# EAGLE board AQ_Baloo_t (EAGLE 5.11)
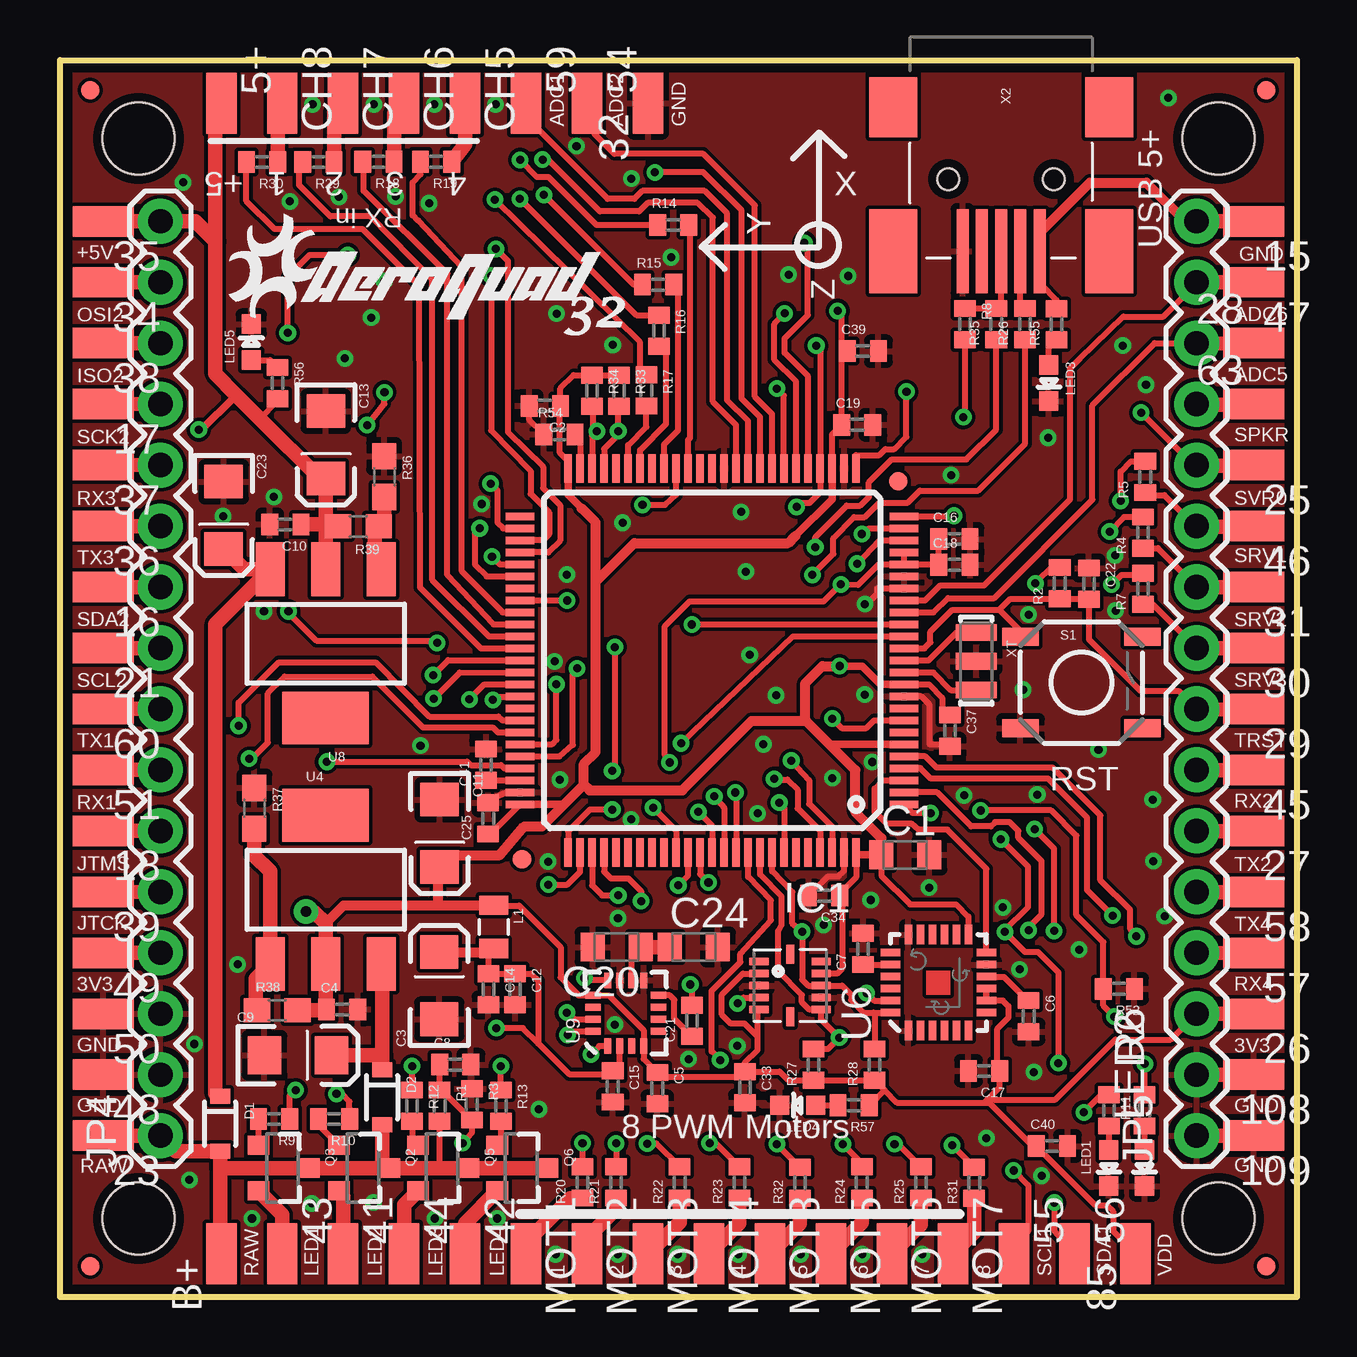
[diagram p1: board, top side]
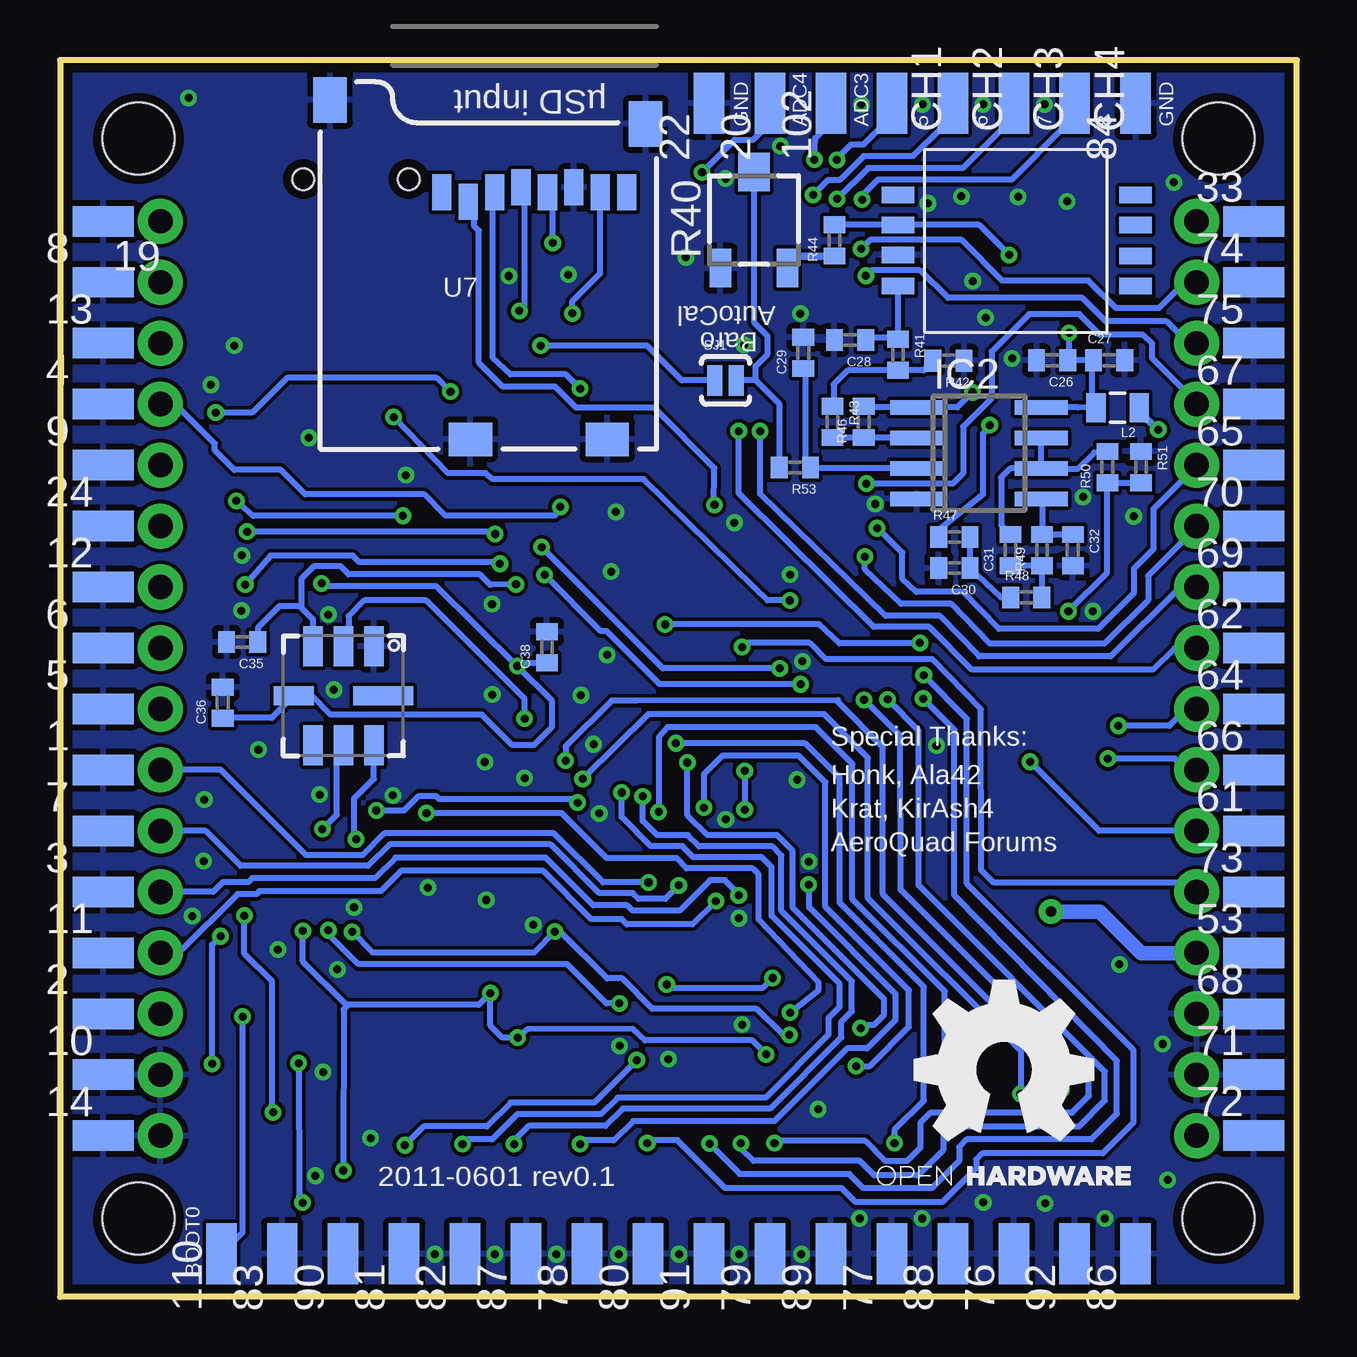
[diagram p2: board, bottom side, seen from below]

Size 51.54 x 51.54 mm. Coordinates in mm from the lower left corner, seen from the top.
Outline: 0,0 0,51.54 51.54,51.54 51.54,0 0,0
Copper layers (1*16): Top 0.0356mm / dielectric 1.5011mm / Bottom 0.0356mm
Design rules "LaenPCBOrder *": minimum track width 6mil, minimum drill 13mil, track to track 6mil, track to pad 6mil, pad to pad 6mil, via to via 6mil, smd to smd 6mil, copper to edge 15mil, drill to drill 6mil, minimum pad ring 7mil, minimum via ring 7mil, stop-mask expansion 4mil, vias tented up to drill 0mil, thermal gap 10mil
Net classes: 0 default: width 0.203 mm; 1 vcc: width 0.254 mm
Holes 3 mm at 3.27,48.27 48.27,48.27 48.27,3.27 3.27,3.27

## Footprints (pad centres in the part's own frame; a part is rotated, then mirrored left to right if it is on the bottom)
SMD1,27-2,54 = smd 1.27 x 2.54: 1 0,0
SMC_Z = smd 1 x 1.2: + -1,0; - 1,0
C0402 = smd 0.7 x 0.9: 1 -0.65,0; 2 0.65,0
EIA3216 = smd 1.4 x 1.6: A 1.4,0; C -1.4,0
SOD-323 = smd 0.63 x 0.83: 1 -1.15,0; 2 1.15,0
TQFP100 = smd 1.2 x 0.3: 1 -8,6; 2 -8,5.5; 3 -8,5; 4 -8,4.5; 5 -8,4; 6 -8,3.5; 7 -8,3; 8 -8,2.5; 9 -8,2; 10 -8,1.5; 11 -8,1; 12 -8,0.5; 13 -8,0; 14 -8,-0.5; 15 -8,-1; 16 -8,-1.5; 17 -8,-2; 18 -8,-2.5; 19 -8,-3; 20 -8,-3.5; 21 -8,-4; 22 -8,-4.5; 23 -8,-5; 24 -8,-5.5; 25 -8,-6; 51 8,-6; 52 8,-5.5; 53 8,-5; 54 8,-4.5; 55 8,-4; 56 8,-3.5; 57 8,-3; 58 8,-2.5; 59 8,-2; 60 8,-1.5; 61 8,-1; 62 8,-0.5; 63 8,0; 64 8,0.5; 65 8,1; 66 8,1.5; 67 8,2; 68 8,2.5; 69 8,3; 70 8,3.5; 71 8,4; 72 8,4.5; 73 8,5; 74 8,5.5; 75 8,6 | smd 0.3 x 1.2: 26 -6,-8; 27 -5.5,-8; 28 -5,-8; 29 -4.5,-8; 30 -4,-8; 31 -3.5,-8; 32 -3,-8; 33 -2.5,-8; 34 -2,-8; 35 -1.5,-8; 36 -1,-8; 37 -0.5,-8; 38 0,-8; 39 0.5,-8; 40 1,-8; 41 1.5,-8; 42 2,-8; 43 2.5,-8; 44 3,-8; 45 3.5,-8; 46 4,-8; 47 4.5,-8; 48 5,-8; 49 5.5,-8; 50 6,-8; 76 6,8; 77 5.5,8; 78 5,8; 79 4.5,8; 80 4,8; 81 3.5,8; 82 3,8; 83 2.5,8; 84 2,8; 85 1.5,8; 86 1,8; 87 0.5,8; 88 0,8; 89 -0.5,8; 90 -1,8; 91 -1.5,8; 92 -2,8; 93 -2.5,8; 94 -3,8; 95 -3.5,8; 96 -4,8; 97 -4.5,8; 98 -5,8; 99 -5.5,8; 100 -6,8
SO08 = smd 0.6 x 2.2: 1 -1.905,-2.6; 2 -0.635,-2.6; 3 0.635,-2.6; 4 1.905,-2.6; 5 1.905,2.6; 6 0.635,2.6; 7 -0.635,2.6; 8 -1.905,2.6
1X16 = drill 1.016 pad 1.88 round: 1 0,0; 2 2.54,0; 3 5.08,0; 4 7.62,0; 5 10.16,0; 6 12.7,0; 7 15.24,0; 8 17.78,0; 9 20.32,0; 10 22.86,0; 11 25.4,0; 12 27.94,0; 13 30.48,0; 14 33.02,0; 15 35.56,0; 16 38.1,0
0805 = smd 0.8 x 1.2: 1 -0.9,0; 2 0.9,0
LED-0603 = smd 0.8 x 0.8: A 0,-0.75; C 0,0.75
SOT23-3 = smd 0.8 x 0.9: 1 -0.95,-1; 2 0.95,-1; 3 0,1.1
0603 = smd 1.1 x 1: 1 -0.85,0; 2 0.85,0
3223J = smd 1.6 x 0.9: 1 -2,1.4; 3 -2,-1.4 | smd 1.6 x 1.3: 2 2,0
TACTILE_SWITCH_SMD = smd 1.524 x 0.762: 1 -2.54,1.905; 2 2.54,1.905; 3 -2.54,-1.905; 4 2.54,-1.905
SJ_2S-NO = smd 0.635 x 1.27: 1 -0.45,0; 2 0.45,0
LGA12 = smd 0.8 x 0.32: P$1 -1.3,1; P$2 -1.3,0.5; P$3 -1.3,0; P$4 -1.3,-0.5; P$5 -1.3,-1; P$7 1.3,-1; P$8 1.3,-0.5; P$9 1.3,0; P$10 1.3,0.5; P$11 1.3,1 | smd 0.32 x 0.8: P$6 0,-1.3; P$12 0,1.3
SOT223 = smd 1.219 x 2.235: 1 -2.311,-3.099; 2 0,-3.099; 3 2.311,-3.099 | smd 3.6 x 2.2: 4 0,3.099
QFN-24 = smd 0.8 x 0.3: 1 -2,1.25; 2 -2,0.75; 3 -2,0.25; 4 -2,-0.25; 5 -2,-0.75; 6 -2,-1.25; 13 2,-1.25; 14 2,-0.75; 15 2,-0.25; 16 2,0.25; 17 2,0.75; 18 2,1.25 | smd 0.3 x 0.8: 7 -1.25,-2; 8 -0.75,-2; 9 -0.25,-2; 10 0.25,-2; 11 0.75,-2; 12 1.25,-2; 19 1.25,2; 20 0.75,2; 21 0.25,2; 22 -0.25,2; 23 -0.75,2; 24 -1.25,2
MICRO-SD-SOCKET-PP = smd 0.8 x 1.5: 1 -8.94,10.7; 2 -7.84,10.3; 3 -6.74,10.7; 4 -5.64,10.9; 5 -4.54,10.7; 6 -3.44,10.9; 7 -2.34,10.7; 8 -1.24,10.7 | smd 1.8 x 1.4: CD1 -2.05,0.4; CD2 -7.75,0.4 | smd 1.4 x 1.9: GND1 -13.6,14.55; GND3 -0.45,13.55
16LPCC = smd 0.65 x 0.28: 1 -1.37,0.75; 2 -1.37,0.25; 3 -1.37,-0.25; 4 -1.37,-0.75; 9 1.37,-0.75; 10 1.37,-0.25; 11 1.37,0.25; 12 1.37,0.75 | smd 0.28 x 0.65: 5 -0.75,-1.37; 6 -0.25,-1.37; 7 0.25,-1.37; 8 0.75,-1.37; 13 0.75,1.37; 14 0.25,1.37; 15 -0.25,1.37; 16 -0.75,1.37
MPX_SMD = smd 1.35 x 0.69 bottom: GND -1.1,4.4; P$1 8.8,5.7; P$2 -1.1,1.9; P$3 8.8,4.45; P$4 8.8,3.15; P$5 8.8,1.9; VCC -1.1,3.15; VOUT -1.1,5.7
BMP085 = smd 1.67 x 0.8: 1 -2.065,1.27; 2 -2.065,0; 3 -2.065,-1.27; 5 2.065,-1.27; 6 2.065,0; 7 2.065,1.27 | smd 0.8 x 1.67: 4 0,-2.065 | smd 0.8 x 2.5: 8 0,1.65
PAD.03X.03 = smd 0.762 x 0.762: P$1 0,0
USB-MINIB-OLD = smd 2.5 x 2: 1 -3,-4.5; 2 -3,4.5 | smd 3.5 x 2: 3 3,-4.5; 4 3,4.5 | smd 3.5 x 0.5: D+ 3,0; D- 3,0.8; GND 3,-1.6; ID 3,-0.8; VBUS 3.01,1.61 | hole 0.9: 0,2.2; 0,-2.2
RESONATOR-SMD = smd 0.7 x 1.7: 1 -1.2,0; 2 0,0; 3 1.2,0

## Placement (x,y rotation side)
1  Ser1  [SMD1,27-2,54]  49.74,21.96 270 bottom
2  Ser1  [SMD1,27-2,54]  49.74,11.8 270 bottom
3  Ser1  [SMD1,27-2,54]  49.74,16.88 270 bottom
4  Ser1  [SMD1,27-2,54]  49.74,37.2 270 bottom
5  Ser1  [SMD1,27-2,54]  49.74,24.5 270 bottom
5+  [SMD1,27-2,54]  6.72,49.74 180 top
6  Ser1  [SMD1,27-2,54]  49.74,27.04 270 bottom
7  Ser1  [SMD1,27-2,54]  49.74,19.42 270 bottom
8  Ser1  [SMD1,27-2,54]  49.74,42.28 270 bottom
9  Ser1  [SMD1,27-2,54]  49.74,34.66 270 bottom
10  Ser1  [SMD1,27-2,54]  49.74,9.26 270 bottom
11  Ser1  [SMD1,27-2,54]  49.74,14.34 270 bottom
12  Ser1  [SMD1,27-2,54]  49.74,29.58 270 bottom
13  Ser1  [SMD1,27-2,54]  49.74,39.74 270 bottom
14  Ser1  [SMD1,27-2,54]  49.74,6.72 270 bottom
15  [SMD1,27-2,54]  49.74,44.82 90 top
16  [SMD1,27-2,54]  1.8,29.58 90 top
17  [SMD1,27-2,54]  1.8,37.2 90 top
18  [SMD1,27-2,54]  1.8,19.42 90 top
19  Ser1  [SMD1,27-2,54]  49.74,44.82 90 bottom
20  Ser1  [SMD1,27-2,54]  21.96,49.74 0 bottom
21  [SMD1,27-2,54]  1.8,27.04 90 top
22  Ser1  [SMD1,27-2,54]  24.5,49.74 0 bottom
23  [SMD1,27-2,54]  1.8,6.72 90 top
24  Ser1  [SMD1,27-2,54]  49.74,32.12 270 bottom
25  [SMD1,27-2,54]  49.74,34.66 90 top
26  [SMD1,27-2,54]  49.74,11.8 90 top
27  [SMD1,27-2,54]  49.74,19.42 90 top
28  Ser1  [SMD1,27-2,54]  49.74,39.74 270 top
29  [SMD1,27-2,54]  49.74,24.5 90 top
30  [SMD1,27-2,54]  49.74,27.04 90 top
31  [SMD1,27-2,54]  49.74,29.58 90 top
32  Ser1  [SMD1,27-2,54]  24.5,49.74 0 top
33  Ser1  [SMD1,27-2,54]  1.8,44.82 270 bottom
34  [SMD1,27-2,54]  1.8,42.28 90 top
35  [SMD1,27-2,54]  1.8,44.82 90 top
36  [SMD1,27-2,54]  1.8,32.12 90 top
37  [SMD1,27-2,54]  1.8,34.66 90 top
38  [SMD1,27-2,54]  1.8,39.74 90 top
39  [SMD1,27-2,54]  1.8,16.88 90 top
41  [SMD1,27-2,54]  11.8,1.8 180 top
42  [SMD1,27-2,54]  16.88,1.8 180 top
43  [SMD1,27-2,54]  9.26,1.8 180 top
44  [SMD1,27-2,54]  14.34,1.8 180 top
45  [SMD1,27-2,54]  49.74,21.96 90 top
46  [SMD1,27-2,54]  49.74,32.12 90 top
47  [SMD1,27-2,54]  49.74,42.28 90 top
48  [SMD1,27-2,54]  1.8,9.26 90 top
49  [SMD1,27-2,54]  1.8,14.34 90 top
50  [SMD1,27-2,54]  1.8,11.8 90 top
51  [SMD1,27-2,54]  1.8,21.96 90 top
53  Ser1  [SMD1,27-2,54]  1.8,14.34 270 bottom
54  Ser1  [SMD1,27-2,54]  21.96,49.74 180 top
55  [SMD1,27-2,54]  39.74,1.8 180 top
56  [SMD1,27-2,54]  42.28,1.8 180 top
57  [SMD1,27-2,54]  49.74,14.34 90 top
58  [SMD1,27-2,54]  49.74,16.88 90 top
59  Ser1  [SMD1,27-2,54]  19.42,49.74 180 top
60  [SMD1,27-2,54]  1.8,24.5 90 top
61  Ser1  [SMD1,27-2,54]  1.8,19.42 270 bottom
62  Ser1  [SMD1,27-2,54]  1.8,27.04 270 bottom
63  Ser1  [SMD1,27-2,54]  49.74,37.2 270 top
64  Ser1  [SMD1,27-2,54]  1.8,24.5 270 bottom
65  Ser1  [SMD1,27-2,54]  1.8,34.66 270 bottom
66  Ser1  [SMD1,27-2,54]  1.8,21.96 270 bottom
67  Ser1  [SMD1,27-2,54]  1.8,37.2 270 bottom
68  Ser1  [SMD1,27-2,54]  1.8,11.8 270 bottom
69  Ser1  [SMD1,27-2,54]  1.8,29.58 270 bottom
70  Ser1  [SMD1,27-2,54]  1.8,32.12 270 bottom
71  Ser1  [SMD1,27-2,54]  1.8,9.26 270 bottom
72  Ser1  [SMD1,27-2,54]  1.8,6.72 270 bottom
73  Ser1  [SMD1,27-2,54]  1.8,16.88 270 bottom
74  Ser1  [SMD1,27-2,54]  1.8,42.28 270 bottom
75  Ser1  [SMD1,27-2,54]  1.8,39.74 270 bottom
76  Ser1  [SMD1,27-2,54]  11.8,1.8 0 bottom
77  Ser1  [SMD1,27-2,54]  16.88,1.8 0 bottom
78  Ser1  [SMD1,27-2,54]  29.58,1.8 0 bottom
79  Ser1  [SMD1,27-2,54]  21.96,1.8 0 bottom
80  Ser1  [SMD1,27-2,54]  27.04,1.8 0 bottom
81  Ser1  [SMD1,27-2,54]  37.2,1.8 0 bottom
82  Ser1  [SMD1,27-2,54]  34.66,1.8 0 bottom
83  Ser1  [SMD1,27-2,54]  42.28,1.8 0 bottom
84  Ser1  [SMD1,27-2,54]  6.72,49.74 0 bottom
85  Ser1  [SMD1,27-2,54]  44.82,1.8 0 top
86  Ser1  [SMD1,27-2,54]  6.72,1.8 0 bottom
87  Ser1  [SMD1,27-2,54]  32.12,1.8 0 bottom
88  Ser1  [SMD1,27-2,54]  14.34,1.8 0 bottom
89  Ser1  [SMD1,27-2,54]  19.42,1.8 0 bottom
90  Ser1  [SMD1,27-2,54]  39.74,1.8 0 bottom
91  Ser1  [SMD1,27-2,54]  24.5,1.8 0 bottom
92  Ser1  [SMD1,27-2,54]  9.26,1.8 0 bottom
102  Ser1  [SMD1,27-2,54]  19.42,49.74 0 bottom
108  [SMD1,27-2,54]  49.74,9.26 90 top
109  [SMD1,27-2,54]  49.74,6.72 90 top
110  [SMD1,27-2,54]  44.82,1.8 0 bottom
B+  [SMD1,27-2,54]  6.72,1.8 0 top
C1  10uF  [SMC_Z]  35.22,18.42 0 top
C2  0.1uF  [C0402]  20.2,37.13 180 top
C3  10uF  [EIA3216]  15.8,12.97 90 top
C4  0.1uF  [C0402]  11.76,11.98 0 top
C5  10nF  [C0402]  24.89,8.7 270 top
C6  0.1uF  [C0402]  40.36,11.7 270 top
C7  2.2nF  [C0402]  33.46,14.5 90 top
C8  0.1µF  [C0402]  16.47,9.68 0 top
C9  10uF (25V)  [EIA3216]  9.92,10.07 0 top
C10  0.1uF  [C0402]  9.39,32.19 180 top
C11  10uF  [EIA3216]  15.82,19.32 270 top
C12  0.1uF  [C0402]  18.96,12.82 270 top
C13  10uF  [EIA3216]  11.08,35.51 270 top
C14  1uF  [C0402]  17.85,12.82 270 top
C15  0.1uF  [C0402]  23.03,8.77 270 top
C16  1uF  [C0402]  37.27,31.58 0 top
C17  0.1uF  [C0402]  38.5,9.42 180 top
C18  10nF  [C0402]  37.27,30.51 0 top
C19  0.1uF  [C0402]  33.22,36.34 0 top
C20  1uF (ESR)  [SMC_Z]  23.19,14.58 180 top
C21  0.22uF  [C0402]  26.33,11.51 90 top
C22  0.1uF  [C0402]  42.87,29.72 270 top
C23  10uF (25V)  [EIA3216]  6.82,32.57 270 top
C24  1uF (ESR)  [SMC_Z]  26.41,14.58 0 top
C25  0.1uF  [C0402]  17.84,19.94 90 top
C26  0.1uF  [C0402]  10.2,39.03 180 bottom
C27  1uF  [C0402]  7.83,39.03 0 bottom
C28  470pF  [C0402]  18.62,39.87 180 bottom
C29  1µF  [C0402]  20.57,39.34 90 bottom
C30  1uF  [C0402]  14.27,30.37 180 bottom
C31  1uF  [C0402]  11.94,31.12 90 bottom
C32  1uF  [C0402]  9.34,31.12 270 bottom
C33  0.1uF  [C0402]  28.54,8.74 270 top
C34  0.1uF  [C0402]  31.84,16.72 180 top
C35  0.1uF  [C0402]  43.95,27.29 180 bottom
C36  0.1uF  [C0402]  44.76,24.76 90 bottom
C37  0.1uF  [C0402]  37.08,23.6 270 top
C38  0.1uF  [C0402]  31.25,27.07 90 bottom
C39  0.1uF  [C0402]  33.45,39.41 0 top
C40  0.1uF  [C0402]  41.33,6.29 0 top
C41  2.2uF  [C0402]  17.75,22.18 90 top
CH1  [SMD1,27-2,54]  16.88,49.74 180 bottom
CH2  [SMD1,27-2,54]  14.34,49.74 180 bottom
CH3  [SMD1,27-2,54]  11.8,49.74 180 bottom
CH4  [SMD1,27-2,54]  9.26,49.74 180 bottom
CH5  [SMD1,27-2,54]  16.88,49.74 180 top
CH6  [SMD1,27-2,54]  14.34,49.74 180 top
CH7  [SMD1,27-2,54]  11.8,49.74 180 top
CH8  [SMD1,27-2,54]  9.26,49.74 180 top
D1  [SOD-323]  6.67,7.22 270 top
D2  [SOD-323]  13.42,8.32 270 top
IC1  STM32F10XVXT6  [TQFP100]  27.17,26.52 180 top
IC2  TS922IN  [SO08]  13.25,35.16 270 bottom
JP4  M16PTH  [1X16]  4.18,6.72 90 top
JP5  M16PTH  [1X16]  47.36,6.72 90 top
L1  100uH  [0805]  18.07,15.42 270 top
L2  100uH  [0805]  7.47,37.05 180 bottom
LED1  Blue  [LED-0603]  43.7,5.37 180 top
LED2  Green  [LED-0603]  45.19,5.37 180 top
LED3  Blue  [LED-0603]  41.2,38.08 180 top
LED4  Blue  [LED-0603]  30.74,7.99 90 top
LED5  Blue  [LED-0603]  7.97,39.79 0 top
MOT1  [SMD1,27-2,54]  19.42,1.8 180 top
MOT2  [SMD1,27-2,54]  21.96,1.8 180 top
MOT3  [SMD1,27-2,54]  24.5,1.8 180 top
MOT4  [SMD1,27-2,54]  27.04,1.8 180 top
MOT5  [SMD1,27-2,54]  32.12,1.8 180 top
MOT6  [SMD1,27-2,54]  34.66,1.8 180 top
MOT7  [SMD1,27-2,54]  37.2,1.8 180 top
MOT8  [SMD1,27-2,54]  29.58,1.8 180 top
Q2  BCV27  [SOT23-3]  12.62,5.37 270 top
Q3  BCV27  [SOT23-3]  9.27,5.37 270 top
Q5  BCV27  [SOT23-3]  15.92,5.37 270 top
Q6  BCV27  [SOT23-3]  19.22,5.37 270 top
R1  10K  [C0402]  15.82,7.97 270 top
R2  10K  [C0402]  41.66,29.74 90 top
R3  1k5  [C0402]  17.16,8.02 270 top
R4  1K  [C0402]  45.13,31.85 90 top
R5  1K  [C0402]  45.22,34.17 90 top
R6  294R  [C0402]  45.19,7.77 270 top
R7  1K  [C0402]  45.12,29.51 90 top
R8  1k5  [C0402]  37.71,40.54 270 top
R9  1k69  [C0402]  8.92,7.42 180 top
R10  1k69  [C0402]  11.42,7.42 180 top
R11  294R  [C0402]  43.7,7.77 90 top
R12  1k69  [C0402]  14.67,7.97 270 top
R13  1k69  [C0402]  18.37,7.97 270 top
R14  1K  [C0402]  25.55,44.67 0 top
R15  1K  [C0402]  24.92,42.18 0 top
R16  1K  [C0402]  24.96,40.26 270 top
R17  1K  [C0402]  24.43,37.77 270 top
R18  1K  [C0402]  13.27,47.3 180 top
R19  1K  [C0402]  15.67,47.3 180 top
R20  1K  [C0402]  21.77,4.77 90 top
R21  1K  [C0402]  23.17,4.77 90 top
R22  1K  [C0402]  25.82,4.77 90 top
R23  1K  [C0402]  28.31,4.77 90 top
R24  1K  [C0402]  33.41,4.77 90 top
R25  1K  [C0402]  35.87,4.77 90 top
R26  22R  [C0402]  40.21,40.54 90 top
R27  4k7  [C0402]  31.4,9.68 90 top
R28  4k7  [C0402]  33.94,9.68 90 top
R29  1K  [C0402]  10.77,47.29 180 top
R30  1K  [C0402]  8.42,47.29 180 top
R31  1K  [C0402]  38.09,4.76 90 top
R32  1K  [C0402]  30.83,4.76 90 top
R33  4k7  [C0402]  23.29,37.76 270 top
R34  4k7  [C0402]  22.17,37.76 270 top
R35  22R  [C0402]  39.01,40.54 90 top
R36  732 (eff.)  [0603]  13.51,34.18 270 top
R37  402R (eff.)  [0603]  8.1,20.36 270 top
R38  243 (eff.)  [0603]  9.05,11.94 0 top
R39  243 (eff.)  [0603]  12.43,32.11 180 top
R40  10k  [3223J]  22.62,44.87 90 bottom
R41  10k  [C0402]  16.62,39.26 270 bottom
R42  10k  [C0402]  14.52,39.01 180 bottom
R43  10k  [C0402]  19.35,36.46 270 bottom
R44  10k  [C0402]  19.27,44.02 90 bottom
R46  220k  [C0402]  18.05,36.46 90 bottom
R47  47k  [C0402]  14.27,31.67 0 bottom
R48  120k  [C0402]  11.28,29.15 0 bottom
R49  6k8  [C0402]  10.62,31.12 90 bottom
R50  5k6  [C0402]  7.9,34.58 90 bottom
R51  10k  [C0402]  6.5,34.58 270 bottom
R52  10K  [C0402]  44.12,12.84 180 top
R53  1M5  [C0402]  20.92,34.56 180 bottom
R54  0k  [C0402]  20.81,35.94 0 top
R55  377R  [C0402]  41.52,40.53 90 top
R56  377R  [C0402]  9.06,38.08 270 top
R57  294R  [C0402]  33.07,7.99 180 top
S1  SW-MOM  [TACTILE_SWITCH_SMD]  42.56,25.6 0 top
SJ1  SOLDERJUMPERNO  [SJ_2S-NO]  23.81,38.19 0 bottom
U3  BMA180  [LGA12]  30.42,12.97 0 top
U4  317  [SOT223]  11.07,16.97 0 top
U6  ITG-3200  [QFN-24]  36.6,13.1 90 top
U7  USD-SOCKETNEW  [MICRO-SD-SOCKET-PP]  26.69,35.33 0 bottom
U8  317  [SOT223]  11.07,27.22 180 top
U9  HMC5883LSMD  [16LPCC]  23.57,11.82 90 top
U$2  MPX_SMD  [MPX_SMD]  15.52,47.82 180 top
U$3  BMP085  [BMP085]  39.73,25.05 270 bottom
U$4  [AQ-WORDS-PT07]  7.03,39.72 0 top
U$5  [OSHW_TEXT]  17.5,4.65 0 bottom
U$7  PAD.03  [PAD.03X.03]  1.27,1.27 0 top
U$9  PAD.03  [PAD.03X.03]  50.27,1.27 0 top
U$10  PAD.03  [PAD.03X.03]  1.27,50.27 0 top
U$11  PAD.03  [PAD.03X.03]  50.27,50.27 0 top
U$12  PAD.03  [PAD.03X.03]  19.25,18.24 0 top
U$13  PAD.03  [PAD.03X.03]  34.93,33.99 0 top
X2  USBOLD  [USB-MINIB-OLD]  39.21,46.58 270 top
XT  8MHz  [RESONATOR-SMD]  38.18,26.49 270 top

## Tracks (layer width: path | path; a pad name or v marks a point on that pad's centre or on a via)
3IN
  Top 0.406: 13.42,13.83 U4.3
  Top 0.61: 13.42,10.16 D2.1 | 13.42,10.16 13.42,13.83 | C9.A 13.33,10.07 13.42,10.16
3V3AN  (via drill 0.34 pad 0.25)
  Top 0.254: 17.92,14.37 L1.2 | C14.1 C12.1 19.62,13.47 19.92,13.17 19.92,10.57 | C14.1 17.77,13.47 17.77,13.62 | L1.2 17.67,14.52 | IC1.21 IC1.22 | C14.1 17.85,14.3 L1.2 | v18.18,11.2 19.29,11.2 19.92,10.57 | IC1.21 36.27,30.52 36.28,30.51 C18.1 C16.1 | IC1.21 34.11,30.52 33.26,29.67 v32.54,29.69 31.82,28.98 26.23,28.98 25.2,27.95 25.2,22.58 v25.4,22.27 | U9.2 23.32,9.71 C15.1 22.89,9.28 21.21,9.28 19.92,10.57
  Top 0.406: C3.A 17.92,14.37
  Bottom 0.254: v18.18,11.2 18.03,11.35 17.61,11.35 17.2,11.76 17.2,12.41 21.01,16.22 21.01,18.59 21.66,19.24 24.56,19.24 25.4,20.08 v25.4,22.27 | v32.54,29.69 33.61,29.67 34.05,30.11 39.51,30.11 39.84,30.44 40.96,30.44 41.48,29.92 41.48,28.72 | 41.48,28.72 41,28.24 U$3.3 | C35.1 43.3,27.88 42.4,28.78 41.54,28.78 41.48,28.72
3V3DIG  (via drill 0.34 pad 0.25, 0.34 pad 0.41, 0.45 pad 1.02)
  Top 0.254: 15.82,16.32 L1.1 19.13,16.31 20.86,14.58 20.86,13.32 21.61,12.57 U9.13 22.87,12.57 24.32,11.12 U9.4 24.32,9.92 C5.1 25,9.18 28.39,9.18 C33.1 | 29.32,11.97 U3.P$5 29.07,11.92 29.07,10.85 | C33.1 28.43,9.5 | 29.07,10.85 29.07,10.29 28.54,9.76 28.54,9.51 28.86,9.19 28.77,9.19 28.58,9.38 C33.1 | 29.07,10.85 28.53,11.39 27.95,11.39 27.58,11.76 27.58,12.6 28.45,13.47 U3.P$2 | IC1.11 36.21,25.52 36.76,24.97 36.76,24.4 C37.1 | C33.1 29.98,9.39 30.34,9.03 R27.1 R28.1 34.37,8.61 | U3.P$10 32.38,13.47 32.59,13.68 32.59,16.62 C34.1 32.49,16.8 33.17,17.48 IC1.100 | 11.07,12.02 C4.1 | v32.48,26.29 32.56,26.27 | IC1.75 19.04,20.52 | C11.A 15.89,17.99 | v40.64,29.73 41.42,30.51 41.54,30.39 R2.2 | R33.1 R34.1 21.4,38.41 20.85,37.86 C2.1 20.83,37.11 20.83,35.17 21.17,34.83 IC1.50 | 31.06,24 31.48,23.58 31.52,23.58 32.88,22.22 32.89,22.22 33.17,21.94 33.17,20.18 34.26,19.09 34.26,19.02 34.15,18.91 34.15,18.35 C1.+ 34.22,17.56 35.42,16.36 37.34,16.36 37.85,15.85 U6.13 | U6.8 U6.9 38.6,12.39 38.61,12.38 38.62,12.38 38.62,12.36 38.63,12.35 | U6.8 | 39.52,12.12 39.53,12.11 39.53,11.65 39.06,11.18 39.06,9.51 C17.1 39.15,8.73 38.78,8.36 | 38.63,12.35 U6.8 | 38.63,12.35 39.29,12.35 39.52,12.12 | 39.52,12.12 39.52,12.11 | 38.52,8.1 38.78,8.36 | 38.52,8.1 34.87,8.1 34.37,8.61 | 38.52,8.1 38.72,8.1 40.53,6.29 C40.1 | JP5.3 46.28,10.72 43.97,10.72 41.47,8.22 38.92,8.22 38.78,8.36 | IC1.28 32.17,35.94 C19.1 32.57,39.3 | 32.57,39.3 32.57,40.92 v32.4,41.09 | C39.1 32.68,39.41 32.57,39.3 | C40.1 40.66,6.16 | 85.1 43.88,2.74 43.88,3.57 43.62,3.83 43.14,3.83 C40.1 | C40.1 40.68,6.23 | C25.1 17.92,19.37 18.02,19.37 IC1.75
  Top 0.254: R57.1 33.75,7.99 34.37,8.61
  Top 0.305: C1.+ 33.27,18.42 IC1.100 | C25.1 18.04,19.39 | IC1.75 19.14,20.49 19.14,20.5 IC1.75 | IC1.75 21,20.52 21.04,20.55 | 32.09,23 32.12,23.02 IC1.6 32.07,23.02 31.08,24.01 | 32.56,26.27 33.43,26.27 34.18,25.52 IC1.11 | IC1.28 32.17,33.24 30.64,31.71 30.63,31.7 | IC1.50 21.17,33.42 21.73,32.86
  Top 0.406: U4.2 | 11.07,15.57 11.82,16.32 15.77,16.32 | 15.77,16.32 L1.1 | 15.77,16.32 15.77,17.92 C11.A 16.59,18.41 18.33,18.41 19.35,19.61 20.09,19.61 21.04,20.55 21.83,21.35 | C4.1 11.07,11.98 | C1.+ 34.22,19.12 33.14,20.2 33.14,21.95 32.09,23 31.08,24.01 31.06,24.03 31.06,25.58 31.77,26.29 v32.48,26.29 | 21.83,21.35 21.83,22.21 22.32,22.7 22.32,29.8 | 22.32,29.8 22.32,32.27 21.73,32.86 | 30.64,31.71 30.34,31.41 23.93,31.41 22.32,29.8 | 31.06,24 28.82,24 25.93,21.11 22.07,21.11 21.83,21.35
  Top 0.61: 11.07,12.02 U4.2 11.07,15.57 10.58,16.06 v10.25,16.06 | R38.2 11.07,11.94 C4.1 | JP5.3 26.1 | 49.1 JP4.4
  Bottom 0.254: U7.4 32.12,46.1 32.18,46.04 32.18,41.31 v32.4,41.09 | 44.49,24.13 44.46,24.1 | 44.49,24.13 42.72,24.13 U$3.4 41.06,25.05 40.27,24.26 33.96,24.26 32.69,22.99 31.8,22.99 31.06,23.73 31.06,24.87 v32.48,26.29 | v32.48,26.29 35.86,29.61 40.52,29.61 v40.64,29.73 | C36.1 44.74,24.13 44.49,24.13 | C38.1 32.35,26.42 v32.48,26.29
  Bottom 0.61: v10.25,16.06 8.21,16.06 6.48,14.33 JP4.4
5IN
  Top 0.61: D1.1 6.57,8.37 6.47,8.47 6.47,28.03 U8.3 7.67,30.32 C23.A
5V  (via drill 0.34 pad 0.25)
  Top 0.254: R56.2 9.06,37.35 8.32,36.6
  Top 0.305: 6.43,49.48 5+.1 | v5.78,36.14 5.81,36.06 7.34,37.57
  Top 0.406: 11.07,32.19 11.75,32.19 R39.2 | C13.A 11.07,33.87 | 6.47,49.48 6.43,49.48
  Top 0.61: 11.07,32.19 U8.2 | 11.07,32.19 C10.1 | 6.47,43.98 6.47,38.47 7.34,37.57 8.32,36.6 10.83,34.11 C13.A | 6.47,43.98 6.47,49.48 | 11.07,33.87 11.07,32.19 | 6.47,43.98 5.63,44.82 JP4.16 35.1
  Bottom 0.305: L2.1 6.59,36.89 v5.78,36.14
ADC12_IN14
  Top 0.254: IC1.33 29.67,36.79 28.95,37.51 28.95,45.48 26.8,47.63 23.1,47.63 22.28,48.45 22.28,49.22 54.1
ADC12_IN15  (via drill 0.34 pad 0.25)
  Top 0.254: IC1.34 29.17,36.66 28.4,37.43 28.4,45.27 26.8,46.87 24.85,46.87 v24.79,46.86
  Bottom 0.254: v24.79,46.86 23.43,48.22 22.65,48.22 22.32,48.55 22.32,49.18 20.1
ADC123_IN10  (via drill 0.34 pad 0.25)
  Top 0.254: R1.1 16.07,8.52 | R3.2 17.12,7.47 | 15.82,8.57 15.82,8.52 | 15.82,8.57 R1.1 | 15.92,8.57 15.82,8.57 | R1.1 C8.1 15.82,8.77 15.92,8.67 15.92,8.57 | R3.2 17.17,6.87 v16.77,6.41 | 15.92,8.57 15.97,8.57 15.97,8.56 R3.2 | IC1.15 30.55,27.52 v25.88,23.07
  Bottom 0.254: v16.77,6.41 16.77,6.96 15.55,8.18 15.55,12.92 19.06,16.43 19.06,21.64 20.49,23.07 v25.88,23.07
ADC123_IN11  (via drill 0.34 pad 0.25)
  Top 0.254: v26.33,28.02 IC1.16 | v9.52,28.57 9.52,28.51 10.68,27.35 15.56,27.35 v15.71,27.25
  Bottom 0.254: v26.33,28.02 19.9,28.02 19.06,27.23 15.9,27.23 v15.71,27.25 | R51.2 R50.1 7.91,32.38 7.91,30.18 v9.52,28.57
ADC123_IN12
  Top 0.254: JP5.14 45.61,39.74 43.02,37.15 43.02,33.22 38.92,29.12 37,29.12 36.4,28.52 IC1.17
  Top 0.61: 28.1 47.38,39.72 JP5.14
ADC123_IN13
  Top 0.254: JP5.15 47.36,42.24 45.97,40.85 44.31,40.85 42.5,39.11 42.09,38.7 42.09,33.23 38.51,29.65 36.68,29.65 36.05,29.02 IC1.18
  Top 0.61: 47.1 JP5.15
BMA_INT  (via drill 0.34 pad 0.25)
  Top 0.254: U3.P$4 28.47,12.47 v28.23,12.23 | IC1.2 36.55,21.02 37.96,19.61 38.79,19.61 38.96,19.78 39.57,19.78 39.93,19.42 39.93,19.13 40.9,18.16 40.9,15.95 40.36,15.41 v40.36,15.28
  Bottom 0.254: v28.23,12.23 28.77,12.23 30.41,13.87 39.11,13.87 40.36,15.12 v40.36,15.28
BMP_INT  (via drill 0.34 pad 0.25)
  Top 0.254: IC1.8 33.92,24.02 33.6,23.7 32.58,23.7 v32.18,24.1
  Bottom 0.254: v32.18,24.1 32.18,24.92 36.28,29.02 38.86,29.02 39.51,28.37 39.51,27.34 U$3.2
BOOT0  (via drill 0.34 pad 0.25)
  Top 0.254: IC1.94 30.17,20.4 v29.97,20.6 | v38.36,20.27 41.3,20.27 42.35,19.22 42.35,15.9 43.47,14.78 R52.2 43.47,12.14 v43.93,11.68
  Bottom 0.254: v29.97,20.6 29.97,20.71 30.01,20.75 35.75,20.75 35.88,20.88 36.59,20.88 37.2,20.27 v38.36,20.27 | v43.93,11.68 43.93,2.69 110.1
GND  (via drill 0.34, 0.34 pad 0.25, 0.34 pad 0.3)
  Top 0.254: IC1.19 34.05,29.52 34.05,29.31 33.63,28.89 33.63,28.82 33.62,28.81 | 36.72,23.03 36.23,23.03 36.23,24.67 35.88,25.02 IC1.10 | 31.19,16.98 C34.2 31.99,17.52 32.43,17.52 32.67,17.76 IC1.99 | IC1.74 18.59,21.02 17.83,20.7 | R54.1 20.16,35.96 19.56,36.56 C2.2 | C11.C 15.95,20.59
  Top 0.61: JP5.2 108.1 | JP5.1 109.1
  other vias: 32.84,42.54 45.53,20.72 13.51,42.33 12.97,40.81 33.53,25.1 43.27,22.81 40.13,25.3 43.96,30.9 32.18,21.62 28.58,30.22 6.8,32.53 33.54,28.87 28.74,26.75 21.12,30.1 46.18,49.96 29.07,20.15 45.25,38.01 19.95,7.82 26.19,9.91 28.22,10.46 37.67,20.9 20.34,18.14 30.36,42.6 44.28,39.64 23.12,11.35 45.56,18.16 5.13,46.44 17.57,33.04 46.03,15.87 8.91,33.34 23.25,15.78 18.15,49.69 21.52,47.95 20.69,40.97 15.38,45.57 41.17,35.8 11.87,39.11 9.58,45.65 11.62,45.84 13.98,45.86 31.82,15.5 39.98,13.65 10.52,49.69 13.08,49.69 15.6,49.69 25.46,43.32 29.84,25.07 28.38,32.71 23.44,32.26 13.07,3.94 10.49,3.9 8,3.27 15.62,3.27 18.22,3.27 20.65,1.78 23.24,1.78 5.39,4.88 23.03,39.67 40.36,28.43 43.98,28.6 8.5,28.57 33.84,22.29 20.83,21.55 23.8,19.9 39.29,16.23 36.21,17.06 33.78,16.54 40.58,9.37 29.31,23.03 20.61,26.48 40.9,5.05 40.72,20.93 38.6,6.62 42.46,14.47 23.81,46.6 37.13,34.24 7.4,13.86 5.6,10.54 25.74,1.78 28.26,1.78 30.86,1.78 33.42,1.78 35.92,1.78 15.02,22.97
  pour Bottom: -0.25,51.87 51.78,51.81 51.87,-0.19 -0.3,-0.07
  pour Top: -0.22,51.81 51.78,51.85 51.89,-0.18 -0.3,-0.08
HMC_INT  (via drill 0.34 pad 0.25)
  Top 0.254: v36.27,20.16 35.53,20.16 IC1.1 | U9.15 21.45,11.57 v21.12,11.85
  Bottom 0.254: v36.27,20.16 30.64,20.16 28.76,18.28 25.85,18.28 25.44,17.86 22.68,17.86 22.43,17.61 22.43,15.72 19.93,13.1 19.93,12.79 v21.12,11.85
ITG_INT
  Top 0.254: IC1.3 34.28,21.52 33.94,21.18 33.94,20.21 34.44,19.71 35.49,19.71 35.78,19.47 36.97,19.47 38.6,17.84 U6.12
JTAG-TRST
  Top 0.254: R2.1 42.85,29.09 C22.2 42.87,27.4 45.02,25.25 46.61,25.25 JP5.8 | IC1.14 36.02,27.02 36.27,27.27 36.27,27.72 37.18,28.63 39.14,28.63 | R2.1 41.59,29.16 41.53,29.1 41.45,29.1 41.44,29.09 39.6,29.09 39.14,28.63 | R2.1 41.64,29.07 | S1.1 40.02,27.75 39.14,28.63
  Top 0.61: 29.1 47.39,24.47 JP5.8
JTCK  (via drill 0.34 pad 0.25)
  Top 0.254: v23.12,27.08 23.12,22.03 v23.01,21.92 | IC1.76 21.17,19.4 22.08,20.31 v23.01,20.31
  Top 0.61: 39.1 JP4.5
  Bottom 0.254: JP4.5 4.55,16.88 4.93,17.26 12.63,17.26 13.16,17.78 13.17,24.48 15.2,26.58 19.63,26.58 20.31,27.25 22.89,27.25 v23.12,27.08 | v23.01,21.92 v23.01,20.31
JTDI/TIM2_CH1  (via drill 0.34 pad 0.25)
  Top 0.254: v20.35,17.18 21.14,17.18 21.67,17.71 IC1.77 | v29.87,6.37 R32.2
  Bottom 0.254: v29.87,6.37 29.72,6.52 28.47,6.52 27.66,7.33 21.77,7.33 18.74,10.36 17.91,10.36 16.72,11.55 16.72,12.62 20.33,16.23 20.33,17.16 v20.35,17.18
JTDO/TIM2_CH2  (via drill 0.34 pad 0.25)
  Top 0.254: v27.26,20.86 27.67,20.39 IC1.89 | v32.62,6.37 33.41,5.58 R24.2
  Bottom 0.254: v32.62,6.37 32.62,6.52 32.01,7.13 28.82,7.13 28.1,7.85 21.95,7.85 18.98,10.82 18.98,11.47 18.55,11.9 18.55,13.16 21.48,16.09 21.48,18.39 21.86,18.77 24.91,18.77 25.38,19.24 26.66,19.24 27.26,19.84 v27.26,20.86
JTMS  (via drill 0.34 pad 0.25)
  Top 0.254: IC1.72 18.53,22.02 18.37,22.16 17.12,22.16 16.96,22.31 v11.12,22.3
  Top 0.61: 18.1 JP4.6
  Bottom 0.254: v11.12,22.3 8.24,19.42 JP4.6
LED1  (via drill 0.34 pad 0.25)
  Top 0.254: v43.86,15.89 42.8,16.95 42.8,19.97 41.17,21.6 36.29,21.6 35.85,22.04 35.19,22.04 IC1.4 | v42.66,7.69 43.39,8.42 R11.2
  Bottom 0.254: v42.66,7.69 42.7,7.73 42.7,13.15 43.86,14.31 v43.86,15.89
LED2  (via drill 0.34 pad 0.25)
  Top 0.254: IC1.5 36.06,22.52 36.53,22.06 41.36,22.06 43.35,20.07 43.35,17.36 44.59,16.13 44.59,15.35 v44.85,15.03 | v45.2,9.71 R6.1
  Bottom 0.254: v44.85,15.03 45.2,14.68 v45.2,9.71
MISO1_LV  (via drill 0.34 pad 0.25)
  Top 0.254: IC1.31 30.67,38.15 29.77,39.05 29.77,40.55 v30.19,40.97 v30.19,40.98
  Bottom 0.254: U7.7 29.03,42.65 30.19,41.49 v30.19,40.98
MISO2_LV  (via drill 0.34 pad 0.25)
  Top 0.254: v17.96,42.55 17.96,36.11 19.61,34.42 19.61,33.46 20.38,32.69 20.38,31.77 20.14,31.53 IC1.53
  Top 0.406: 38.1 1.99,39.74
  Top 0.61: 1.99,39.74 JP4.14
  Bottom 0.254: v17.96,42.55 17.74,42.77 15.7,42.77 14.53,41.63 8.94,41.63 7.96,40.65 5.43,40.65 4.51,39.74 JP4.14
MOSI1_LV  (via drill 0.34 pad 0.25)
  Top 0.254: IC1.32 30.16,37.56 v29.87,37.85
  Bottom 0.254: v29.87,37.85 30.46,38.44 32.76,38.44 33.5,39.13 33.5,46.01 U7.3
MOSI2_LV  (via drill 0.34 pad 0.25)
  Top 0.254: v18.16,43.67 18.66,43.17 18.66,36.03 20.13,34.59 20.13,33.7 20.84,32.99 20.84,31.51 20.35,31.02 IC1.54
  Top 0.61: 34.1 JP4.15
  Bottom 0.24: 15.65,44.05 17.78,44.05 v18.16,43.67
  Bottom 0.254: JP4.15 4.67,42.28 5.75,41.2 7.54,41.2 8.69,42.35 12.28,42.35 13.98,44.05 15.65,44.05
N$1
  Top 0.254: IC1.12 36.39,26.02 37.12,25.29 XT.3
N$2
  Top 0.254: XT.1 37.36,27.69 36.19,26.52 IC1.13
N$3  (via drill 0.34 pad 0.25)
  Top 0.254: R17.1 24.15,38.54 24.15,39.81 v18.12,45.72
  Bottom 0.254: CH4.1 9.75,49.25 9.75,48.69 11.88,46.56 17.46,46.56 18.12,45.9 v18.12,45.72
N$4
  Top 0.61: R20.1 21.27,4.12 19.42,2.27 MOT1.1
N$5
  Bottom 0.254: R40.2 22.77,46.72 | R40.2 22.14,46.39 | 22.56,38.19 SJ1.2 | 22.56,38.19 21.56,37.19 R53.2 | 22.56,38.19 22.56,38.79 22.06,39.29 22.06,40.04 22.61,40.59 R40.2
N$6
  Top 0.254: C6.1 40.32,12.35 39.33,13.34 U6.10
N$7
  Top 0.254: LED2.A R6.2
N$8
  Top 0.254: C7.1 U6.20
N$9
  Top 0.254: R9.2 Q3.1
N$10
  Top 0.254: IC1.49 21.67,35.65 R54.2
N$11
  Top 0.254: R10.2 10.77,7.17 Q2.1
N$12
  Top 0.254: R12.2 14.67,6.57 Q5.1
N$13
  Top 0.61: R21.1 23.17,3.68 21.96,2.47 MOT2.1
N$14
  Top 0.61: 24.47,1.83 MOT3.1 25.82,3.12 R22.1
N$15
  Top 0.254: R11.1 LED1.A
N$16
  Top 0.254: 13.12,32.12 R39.1
  Top 0.406: 13.12,30.92 13.07,30.87 13.07,30.53 U8.1 13.27,30.31 | R39.1 13.21,32.31
  Top 0.61: 13.12,30.92 13.12,32.12 | R36.2 13.51,32.34 R39.1
N$17  (via drill 0.34 pad 0.25)
  Top 0.254: R14.1 22.35,44.67 20.35,46.67 19.87,46.67 v19.17,47.38
  Bottom 0.254: CH1.1 16.68,49.4 18.07,48.01 18.59,48.01 19.05,47.55 v19.17,47.38
N$18  (via drill 0.34 pad 0.25)
  Top 0.254: R15.1 23.9,42.18 v20.16,45.92
  Bottom 0.254: v20.16,45.92 19.55,46.53 19.06,46.53 18.06,47.53 16,47.53 14.79,48.74 14.79,49.29 CH2.1
N$19  (via drill 0.34 pad 0.25)
  Top 0.254: R16.1 24.02,40.91 v19.16,45.75
  Bottom 0.254: v19.16,45.75 17.87,47.04 13.92,47.04 12.2,48.76 12.2,49.34 CH3.1
N$20
  Top 0.61: R23.1 28.31,3.07 MOT4.1
N$21
  Top 0.61: R19.1 16.88,48.03 CH5.1
N$22
  Top 0.61: R18.1 13.92,49.32 CH6.1
N$23
  Top 0.254: R13.2 18.37,6.47 Q6.1
N$24
  Top 0.406: Q2.2 11.77,4.27
  Top 0.61: Q2.2 11.6,4.4 11.8,4.2 41.1
N$25
  Top 0.61: Q6.2 16.88,3.08 42.1
N$26
  Top 0.61: Q3.2 9.26,3.43 43.1
N$27
  Top 0.61: Q5.2 14.34,3.84 44.1
N$28
  Top 0.254: C41.1 IC1.73
N$29
  Top 0.254: LED3.A 41.2,39.56 R55.1
N$30
  Top 0.61: R29.1 11.42,49.36 CH7.1
N$31
  Top 0.61: R24.1 33.41,3.09 MOT5.1
N$32
  Top 0.61: R25.1 35.87,3.01 MOT6.1
N$33
  Top 0.254: U4.1 8.5,13.61 | R38.1 8.15,12.01
  Top 0.61: 8.15,12.01 8.15,13.26 U4.1 8.76,17.73 8.1,18.39 R37.2
N$34
  Top 0.254: LED4.A R57.2
N$35
  Top 0.254: LED5.A 8.75,39.04 R56.1
N$37
  Top 0.61: R30.1 9.07,49.55 CH8.1
N$38
  Top 0.61: R31.1 38.09,2.69 MOT7.1
N$39
  Top 0.61: R32.1 30.83,3.05 MOT8.1
N$41
  Top 0.254: U9.8 25.41,12.57 25.6,12.38 25.6,11.59 C21.1
N$42  (via drill 0.34 pad 0.25)
  Top 0.254: C21.2 26.33,12.95 v26.26,13.02 | U9.12 21.95,13.19 v21.85,13.29
  Bottom 0.254: v21.85,13.29 22.27,12.87 26.11,12.87 v26.26,13.02
N$43  (via drill 0.34 pad 0.25)
  Top 0.254: v9.49,40.17 9.49,42.5 10.41,43.42 v11.99,43.42
  Bottom 0.254: R44.2 U$2.VCC 13.24,44.67 v11.99,43.42 | C26.1 9.52,39.42 9.49,39.42 v9.49,40.17 | C26.1 C27.1 8.52,38.98 8.52,37.2 L2.2 9.12,37.07 IC2.8 | C26.1 9.47,39.08
N$67
  Top 0.254: C20.+ 23.82,14.57 U9.10
  Top 0.61: C20.+ C24.+
N$72
  Top 0.254: R8.1 R35.2 39.21,41.39 X2.D+
N$74
  Top 0.254: X2.D- 40.01,41.39 R26.2
N$76
  Bottom 0.254: 16.27,42.07 16.32,42.12 U$2.VOUT R41.1 16.68,39.97 17.97,39.97 C28.1
N$77
  Bottom 0.254: R43.1 19.31,37.15 19.31,38.02 18.72,38.61 R41.2 15.57,38.61 R42.2
N$79
  Bottom 0.254: R43.2 R46.1 16.77,35.8 IC2.2
N$80
  Bottom 0.254: R53.1 20.47,34.8 20.47,38.59 C29.1 | R53.1 20.49,34.73 | IC2.3 20.23,34.53 R53.1
N$81
  Bottom 0.254: R40.3 21.12,42.87 21.07,42.82
  Bottom 0.305: R44.1 21.22,43.37 R40.3
N$82  (via drill 0.34 pad 0.25)
  Top 0.254: v13.52,37.69 13.52,37.21 v12.8,36.33
  Bottom 0.254: v12.8,36.33 12.81,36.3 13.08,35.97 13.08,33.44 14.92,31.97 R47.1 | R46.2 18,37.07 IC2.1 14.14,37.07 v13.52,37.69
N$98
  Bottom 0.254: R47.2 C30.1 12.33,29.15 R48.1
N$99
  Bottom 0.254: C31.1 R49.1 10.63,30.56 R48.2
N$100
  Bottom 0.254: C32.1 R49.2 10.62,33.23 IC2.5
N$101
  Bottom 0.254: IC2.6 IC2.7 | R50.2 8.45,35.18 9.15,34.49 10.62,34.49 IC2.6 | IC2.6 11.96,34.53 12.33,34.15 12.33,32.16 C31.2
NSS1_LV/DAC_OUT1  (via drill 0.34 pad 0.25)
  Top 0.254: v30.69,32.92 30.85,33.08 31.21,33.08 31.67,33.54 IC1.29 31.67,39.48 v31.51,39.64
  Top 0.406: 49.56,37.18 63.1
  Top 0.61: 49.56,37.18 47.38,37.18 JP5.13
  Bottom 0.254: v30.69,32.92 30.92,32.56 35.48,32.56 36.36,33.44 41.32,33.44 42.34,34.46 44.27,34.46 45.09,35.28 45.09,35.56 46.73,37.2 JP5.13 | v31.51,39.64 27.08,39.64 25.63,38.19 SJ1.1
PD11  (via drill 0.34 pad 0.25)
  Top 0.254: R8.2 37.71,36.66 v37.64,36.66 | IC1.58 v21.13,29.02
  Bottom 0.254: v37.64,36.66 35.38,34.33 33.82,34.33 33.5,34.08 27.22,34.08 22.59,29.55 22.06,29.02 v21.13,29.02
PE10  (via drill 0.34 pad 0.25)
  Top 0.254: IC1.41 25.67,33.42 25.21,33 v24.27,33
  Bottom 0.254: v24.27,33 24.27,32.81 24.3,32.84 24.27,34.54 26.79,37.06 30.04,37.06 30.91,37.93 33.09,37.93 34.09,38.93 34.09,44.43 34.28,44.62 34.28,45.14 34.26,45.16 34.53,45.43 U7.2
PLED1  (via drill 0.34 pad 0.25)
  Top 0.254: R12.1 v14.67,9.62 | IC1.88 27.17,19.64 v26.6,20.21
  Bottom 0.254: v14.67,9.62 14.67,12.73 18.52,16.58 18.52,22.21 20.05,23.74 26.22,23.74 26.59,23.33 v26.59,20.22 v26.6,20.21
PLED2  (via drill 0.34 pad 0.25)
  Top 0.254: IC1.97 31.67,19.42 30.73,20.36 30.73,21.14 30.31,21.56 29.79,21.56 v29.76,21.59 | 12.07,7.87 R10.1 12.06,8.14 11.74,8.46 v11.52,8.46
  Bottom 0.254: 11.52,8.64 v11.52,8.46 11.49,8.49 11.49,10.23 17.88,16.62 17.88,22.46 19.7,24.28 19.7,24.29 27.02,24.28 29.67,21.67 v29.76,21.59
PLED3  (via drill 0.34 pad 0.25)
  Top 0.254: IC1.98 32.17,19.59 31.21,20.55 31.21,21.53 v30.47,22.35 | R9.1 9.57,8.37 v9.82,8.62
  Bottom 0.254: v9.82,8.62 9.82,9.34 17.25,16.77 17.25,22.91 19.12,24.78 19.12,24.87 27.5,24.85 28.56,24.85 30.47,22.94 v30.47,22.35
PLED4  (via drill 0.34 pad 0.25)
  Top 0.254: R13.1 v18.37,9.62 | IC1.85 25.67,19.43 v24.71,20.39
  Bottom 0.254: v18.37,9.62 17.8,9.62 16.17,11.25 16.17,12.77 19.65,16.25 19.65,21.45 20.75,22.55 23.95,22.55 24.71,21.79 v24.71,20.39
RAW
  Top 0.254: R1.2 15.82,5.52 15.97,5.37
  Top 0.406: Q2.3 13.22,5.37 13.42,5.57 | 6.67,1.8 B+.1
  Top 0.61: 13.22,5.37 Q3.3 6.67,5.37 | Q6.3 Q5.3 15.97,5.37 Q2.3 | 13.42,5.57 D2.2 | 23.1 JP4.1 4.83,6.07 D1.2 6.67,5.37 | 6.67,5.37 6.67,1.8
SCK1_LV/DAC_OUT2  (via drill 0.34 pad 0.25)
  Top 0.254: IC1.30 31.17,38.36 30.19,39.34 30.19,39.94 31.16,40.91 31.16,43.77 v31.01,43.92
  Bottom 0.254: U7.5 31.23,45.69 31,45.46 31.01,45.45 v31.01,43.92
SCK2_LV  (via drill 0.34 pad 0.25)
  Top 0.254: v17.94,33.89 18.22,33.61 18.22,32.26 18.46,32.02 IC1.52
  Top 0.61: 17.1 4.16,37.22 JP4.13
  Bottom 0.254: JP4.13 4.18,37.26 6.04,39.12 6.04,39.73 6.41,40.09 8.21,40.09 9.07,40.95 11.16,40.95 12.72,39.39 12.72,37.45 13.91,36.26 13.91,34.32 14.34,33.89 v17.94,33.89
SCL1_LV  (via drill 0.34 pad 0.25)
  Top 0.254: IC1.92 29.17,17.6 30.07,16.68 30.07,15.5 29.92,15.24 29.92,13.57 30.91,12.58 30.91,12.28 31.22,11.97 U3.P$7 31.72,11.56 v32.47,10.81 31.99,10.33 R27.2 | v41.42,15.25 41.42,18.68 v40.61,19.49 | U6.23 33.92,12.35 v33.61,12.66 | v39.73,5.27 40.34,4.66 40.34,2.73 39.74,2.13 55.1 | U9.1 22.46,10.45 v22.12,10.11
  Top 0.61: 39.53,2.45 39.74,2.24 55.1 39.74,2.47
  Bottom 0.254: v40.61,19.49 40,20.1 40,22.29 39.73,22.56 U$3.6 | v22.12,10.11 22.69,10.69 27.16,10.69 27.67,11.17 32.09,11.15 v32.47,10.81 33.11,10.81 33.61,11.31 v33.61,12.66 34.1,12.17 39.53,12.17 | v41.42,15.25 41.42,13.97 39.62,12.17 39.53,12.17 | v39.73,5.27 39.72,11.98 39.53,12.17
SCL2_LV  (via drill 0.34 pad 0.25)
  Top 0.254: IC1.47 22.67,35.34 23.26,35.93 v23.26,36.08 23.26,37.08 R33.2
  Top 0.61: 21.1 JP4.9
  Bottom 0.254: JP4.9 5.1,27.04 6,26.14 13.55,26.14 15.33,27.92 17.63,27.92 23.17,33.4 23.26,33.49 v23.26,36.08
SDA1_LV  (via drill 0.34 pad 0.25)
  Top 0.254: v30.92,15.22 30.92,15.17 | v30.92,15.22 30.92,13.22 31.17,12.97 U3.P$9 32.59,12.97 32.96,12.6 32.96,12.38 33.49,11.85 33.9,11.85 | IC1.93 29.67,17.73 30.52,16.87 30.52,15.56 v30.92,15.22 | v39.2,19.07 40.34,17.93 40.34,16.24 39.37,15.27 v39.37,15.21 40.2,14.38 40.74,14.38 41.6,13.52 v41.6,9.74 | 33.9,11.85 U6.24 | R28.2 33.94,11.81 33.9,11.85 | v41.43,3.93 41.43,2.75 56.1 | U9.16 21.3,11.07 v21.15,10.92
  Bottom 0.254: v39.37,15.21 38.51,14.35 31.79,14.35 v30.92,15.22 30.69,15.22 28.74,13.27 28.11,13.27 26.86,12 22.51,12 21.41,10.92 v21.15,10.92 | U$3.7 38.46,21.59 39.28,20.77 39.28,19.12 v39.2,19.07 | v41.6,9.74 41.58,4.18 v41.43,3.93
SDA2_LV  (via drill 0.34 pad 0.25)
  Top 0.254: 21.89,37.08 R34.2 22.21,36.79 22.21,36.23 v22.37,36.07 22.17,35.87 IC1.48
  Top 0.61: 16.1 JP4.10
  Bottom 0.254: JP4.10 4.87,29.58 7.76,26.69 13.24,26.69 14.88,28.38 17.13,28.38 22.36,33.46 22.37,33.47 v22.37,36.07
SERVO1
  Top 0.254: JP5.11 47.31,32.12 46.02,33.41 45.33,33.41 R5.1
  Top 0.406: 49.55,32.1 46.1
  Top 0.61: 49.55,32.1 47.38,32.1 JP5.11
SERVO2
  Top 0.254: R4.1 45.74,31.2 JP5.10
  Top 0.61: 31.1 JP5.10
SERVO3
  Top 0.254: R7.1 45.54,28.86 JP5.9
  Top 0.61: 30.1 47.38,27.02 JP5.9
TIM1_CH1
  Top 0.254: R14.2 26.24,44.59 | R14.2 26.17,44.64 | IC1.40 26.17,35.71 26.26,35.8 26.26,44.61 R14.2
TIM1_CH2
  Top 0.254: R15.2 25.76,42.09 25.76,36.11 25.17,35.52 IC1.42
TIM1_CH3
  Top 0.254: R16.2 25.26,39.43 25.26,36.38 24.17,35.29 IC1.44
TIM1_CH4
  Top 0.254: IC1.45 23.67,35.49 24.43,36.25 R17.2
TIM3_CH1  (via drill 0.34 pad 0.25)
  Top 0.254: IC1.90 28.17,20.99 v28.14,21.02 | v34.77,6.37 34.92,6.37 R25.2
  Bottom 0.254: v34.77,6.37 34.57,6.57 33.53,6.57 32.48,7.62 29,7.62 28.31,8.31 22.14,8.31 19.51,10.94 19.51,11.64 19.06,12.09 19.06,13.05 21.89,15.88 21.89,17.91 22.31,18.33 25.16,18.33 25.61,18.78 26.92,18.78 28.14,20 v28.14,21.02
TIM3_CH2  (via drill 0.34 pad 0.25)
  Top 0.254: IC1.91 28.67,17.5 29.62,16.52 29.62,15.7 28.35,14.31 28.35,13.95 27.15,12.75 27.15,10.23 v27.51,9.87 | v37.17,6.32 v37.18,6.32 R31.2
  Bottom 0.254: v37.17,6.32 36.38,7.11 33.75,7.11 32.76,8.1 29.28,8.1 v27.51,9.87
TIM3_CH3
  Top 0.254: IC1.35 28.67,36.5 27.8,37.37 27.8,45.15 26.86,46.09 24.27,46.09 23.93,45.75 22.82,45.75 19.36,49.21 19.43,49.53 59.1
TIM3_CH4  (via drill 0.34 pad 0.25)
  Top 0.254: IC1.36 28.17,36.33 27.2,37.31 27.2,44.98 26.57,45.59 24.49,45.59 24.13,45.23 22.49,45.23 20.21,47.51 20.1,47.53 v20.11,47.39
  Bottom 0.254: 102.1 19.22,49.15 20.08,48.29 v20.11,47.39
TIM4_CH1
  Top 0.254: IC1.59 18.44,28.52 16.74,30.23 16.73,42.9 14.93,44.85 14.91,44.85 14.69,45.07 14.69,46.44 15.02,46.77 R19.2 | R19.2 15.02,47.22 14.93,47.22 | R19.2 15,47.45
TIM4_CH2
  Top 0.254: IC1.60 18.06,28.02 16.14,30.08 16.14,42.64 12.65,46.09 12.65,47.44 R18.2 12.61,47.46
TIM4_CH3
  Top 0.254: IC1.61 17.87,27.52 15.52,29.87 15.52,42.39 12.92,45.02 11.27,45.02 9.96,46.33 9.96,47.36 R29.2 10.12,47.34
TIM4_CH4
  Top 0.254: IC1.62 17.54,27.02 15,29.56 14.96,42.14 12.61,44.49 8.94,44.49 7.77,45.66 R30.2
TIM5_CH1  (via drill 0.34 pad 0.25)
  Top 0.254: R7.2 45.05,30.09 44.23,30.09 v43.82,29.68 | IC1.23 34.14,31.52 v33.21,30.55
  Bottom 0.254: 33.15,30.53 v33.21,30.55 33.28,30.62 39.07,30.62 39.34,30.89 42.76,30.89 v43.82,29.68
TIM5_CH2  (via drill 0.34 pad 0.25)
  Top 0.254: IC1.24 33.7,32.02 v33.41,31.78 v33.41,31.79 | R4.2 44.34,32.5 v43.74,31.89
  Bottom 0.254: v43.74,31.89 33.58,31.89 v33.41,31.79
TIM5_CH3  (via drill 0.34 pad 0.25)
  Top 0.254: IC1.25 37.01,32.52 v37.25,32.55 | v44.19,33.17 44.19,34.39 44.62,34.82 R5.2
  Bottom 0.254: v37.25,32.55 43.48,32.55 v44.19,33.17
TIM5_CH4  (via drill 0.34 pad 0.25)
  Top 0.254: JP5.12 47.36,34.83 47.07,34.83 v45.05,36.85 | v35.28,37.71 v35.27,37.72 35.27,35.84 34.76,35.33 34.39,35.33 34.14,35.08 33.17,35.08 33.15,35.06 33.15,34.54 IC1.26
  Top 0.406: 49.55,34.64 25.1
  Top 0.61: 49.55,34.64 47.38,34.64 JP5.12
  Bottom 0.254: v45.05,36.85 43.53,36.85 42.08,38.3 35.85,38.3 v35.27,37.72
TIM8_CH1  (via drill 0.34 pad 0.25)
  Top 0.254: v27.07,6.41 27.32,6.41 R23.2 | IC1.63 16.17,26.53 v15.55,25.91
  Bottom 0.254: v27.07,6.41 26.95,6.53 25.82,6.53 23.83,4.54 18.97,4.54 18.38,3.95 14.78,3.95 13.37,5.36 13.37,5.72 13.11,5.98 8.1,5.98 6.81,7.27 6.81,10.27 13.75,17.22 13.75,24.09 15.5,25.86 v15.55,25.91
TIM8_CH2  (via drill 0.34 pad 0.25)
  Top 0.254: v24.47,6.39 24.85,6.39 R22.2 | IC1.64 16.65,26.01 v15.57,24.93
  Bottom 0.254: v24.47,6.39 23.22,5.14 23.22,5.12 18.65,5.12 18.07,4.54 15.21,4.54 14.08,5.67 14.08,6.24 13.75,6.57 8.57,6.57 7.5,7.64 7.5,9.84 14.27,16.73 14.27,23.63 v15.57,24.93
TIM8_CH3  (via drill 0.34 pad 0.25)
  Top 0.254: v23.17,6.4 R21.2 | IC1.65 17.68,25.52 v17.06,24.9
  Bottom 0.254: v23.17,6.4 23.17,6.2 22.64,5.67 18.21,5.67 17.61,5.07 15.79,5.07 14.74,6.12 14.74,6.84 14.48,7.1 9.09,7.1 8,8.19 8,9.39 15.76,17.15 15.76,23.6 v17.06,24.9
TIM8_CH4  (via drill 0.34 pad 0.25)
  Top 0.254: v21.77,6.41 R20.2 | v18.04,24.88 18.17,25.01 IC1.66
  Bottom 0.254: v21.77,6.41 21.68,6.5 17.99,6.5 17.15,5.66 16.25,5.66 15.69,6.22 15.69,7.26 15.28,7.67 9.38,7.67 8.67,8.38 8.67,9.12 16.51,16.96 16.54,23.38 v18.04,24.88
UART1_RX  (via drill 0.34 pad 0.25)
  Top 0.254: v7.88,22.43 7.99,22.43 8.66,23.1 8.66,25.15 9.36,25.85 13.02,25.85 15.12,23.73 18.03,23.73 18.24,23.52 IC1.69
  Top 0.61: 51.1 JP4.7
  Bottom 0.254: v7.88,22.43 5.09,22.43 4.62,21.96 JP4.7
UART1_TX  (via drill 0.34 pad 0.25)
  Top 0.254: v7.44,23.8 7.44,24.76 9.12,26.44 13.15,26.44 15.39,24.18 18.27,24.18 18.43,24.02 IC1.68
  Top 0.61: 60.1 JP4.8
  Bottom 0.254: v7.44,23.8 5.32,23.8 4.62,24.5 JP4.8
UART2_RX  (via drill 0.34 pad 0.25)
  Top 0.254: IC1.87 26.67,17.62 v27.02,17.27
  Top 0.406: 49.57,21.94 45.1
  Top 0.61: 49.57,21.94 47.38,21.94 JP5.7
  Bottom 0.254: v27.02,17.27 28.91,17.27 30.96,19.32 38.02,19.32 38.93,18.41 41.29,18.41 44.84,21.96 JP5.7
UART2_TX  (via drill 0.34 pad 0.25)
  Top 0.254: IC1.86 26.17,17.56 v25.76,17.15 | JP5.6
  Top 0.406: 49.57,19.4 27.1
  Top 0.61: 49.57,19.4 47.38,19.4 JP5.6
  Bottom 0.254: v25.76,17.15 26.32,16.59 27.43,16.59 27.67,16.83 29.07,16.83 31.1,18.86 37.81,18.86 38.71,17.96 44.01,17.96 45.47,19.42 JP5.6
UART3_RX  (via drill 0.34 pad 0.25)
  Top 0.254: IC1.56 17.78,30.02 17.29,30.51 17.29,31.83 v17.49,32.03
  Top 0.61: 37.1 JP4.12
  Bottom 0.254: JP4.12 4.18,34.63 5.97,32.84 5.97,31.17 6.78,30.36 6.78,29.34 8.28,27.84 12.42,27.84 13.92,29.38 15.86,29.38 16.44,29.92 16.44,31.01 17.46,32.03 v17.49,32.03
UART3_TX  (via drill 0.34 pad 0.25)
  Top 0.254: IC1.55 18.33,30.52 v18,30.85
  Top 0.61: 36.1 JP4.11
  Bottom 0.254: JP4.11 4.18,32.07 6.2,30.05 6.2,29.04 8.02,27.22 12.8,27.22 14.4,28.88 16.49,28.88 18,30.33 v18,30.85
UART4_RX  (via drill 0.34 pad 0.25)
  Top 0.254: IC1.79 22.67,17.72 22.95,17.44 23.68,17.44 24.21,16.91 v24.21,16.49
  Top 0.61: 57.1 47.38,14.32 JP5.4
  Bottom 0.254: JP5.4 46.59,14.34 44.14,16.79 43.35,16.79 43.23,16.91 38.17,16.91 37.33,17.75 31.41,17.75 29.4,15.74 28.14,15.74 27.92,15.52 25.19,15.52 v24.22,16.49 v24.21,16.49
UART4_TX  (via drill 0.34 pad 0.25)
  Top 0.254: IC1.78 22.17,17.15 22.59,16.73 v23.26,16.73
  Top 0.406: 49.57,16.86 58.1
  Top 0.61: 49.57,16.86 47.38,16.86 JP5.5
  Bottom 0.254: JP5.5 45.16,16.88 44.75,17.29 43.69,17.29 43.53,17.45 38.42,17.45 37.56,18.31 31.31,18.31 29.32,16.32 27.9,16.32 27.68,16.1 25.72,16.1 24.45,17.37 23.84,17.37 23.26,16.79 v23.26,16.73
USBDM  (via drill 0.34 pad 0.25)
  Top 0.254: IC1.70 20.5,23.03 20.68,23.21 v20.68,25.53 | 39.91,39.75 40.04,39.88 R26.1 40.21,35.56 38.25,33.6 35.83,33.6 35.33,33.1 34.14,33.1 33.53,32.49 33.08,32.49 32.22,31.62 32.22,30.96 v31.35,30.09
  Bottom 0.254: v20.68,25.53 24.15,25.54 26.56,25.54 28.76,27.74 29,27.74 v31.35,30.09
USBDP  (via drill 0.34 pad 0.25)
  Top 0.254: 39.31,39.73 39.28,39.76 39.23,39.76 39.1,39.89 R35.1 39.01,36.14 37.77,34.9 34.66,34.9 33.7,33.94 33.7,33.33 33.34,32.97 32.78,32.97 31.47,31.66 v31.47,31.24 | IC1.71 20.82,22.52 21.37,23 21.37,25.94 v21.55,26.19
  Bottom 0.254: v21.55,26.19 26.42,26.19 v31.47,31.24
VBUS
  Top 0.254: R55.2 41.52,41.54 40.9,42.16 40.9,43.49 X2.VBUS
  Top 0.406: X2.VBUS 40.82,44.34 42.91,46.43 45.27,46.43 46.88,44.82 JP5.16
  Top 0.61: JP5.16 15.1

## Text on the board
tPlace: ADC1 | ADC2 | GND | +5 | 1 | 2 | 3 | 4 | RX in | X | Y | USB 5+ | +5V | GND | Z | OSI2 | ADC6 | ISO2 | ADC5 | SCK2 | SPKR | RX3 | SVR0 | TX3 | SRV1 | SDA2 | SRV2 | SCL2 | SRV3 | TX1 | TRST | RX1 | RST | RX2 | JTMS | TX2 | JTCK | TX4 | 3V3 | RX4 | GND | 3V3 | GND | GND | 8 PWM Motors | RAW | GND | RAW | LED1 | LED2 | LED3 | LED4 | 1 | 2 | 3 | 4 | 5 | 6 | 7 | 8 | SCL1 | SDA1 | VDD
bPlace: µSD input | GND | 8 | 7 | 6 | 5 | ADC3 | ADC4 | GND | AutoCal | Baro | Special Thanks: | Honk, Ala42 | Krat, KirAsh4 | AeroQuad Forums | 2011-0601 rev0.1 | BOOT0
Reference: Insert | Baro Calibration Pot | Below | Baro Super | (MPX SCC) | Below | USB | 8x PWM in | 4x ADC | 50x50mm | 45x45 holes | 5V/1A -> | <- USB 5V | <- 2x ADC | SPI2 -> | <- And music speaker! | <- PA3 TIM5_CH4 | UART3 -> | <- 3x Servo | I2C2 -> | <- Reset button | <- TRST | UART1 -> | <- BMP085 below | <- UART2 | JTMS -> | <- On-board LED's | JTCK -> | <- UART4_TX | 3V3/1A -> | <- UART4_RX | GND -> | <- 3V3 | <- HMC/BMA/ITG | <- GND | GND -> | RAW -> | <- GND | GND 3V3 RX TX | BAT | I2C1 | (Max 25V) | 8x PWM out | 4x 12V LED's | (0.6A each) | BOOT0 | 1.7" = 43.18mm EXACTLY! (side headers)